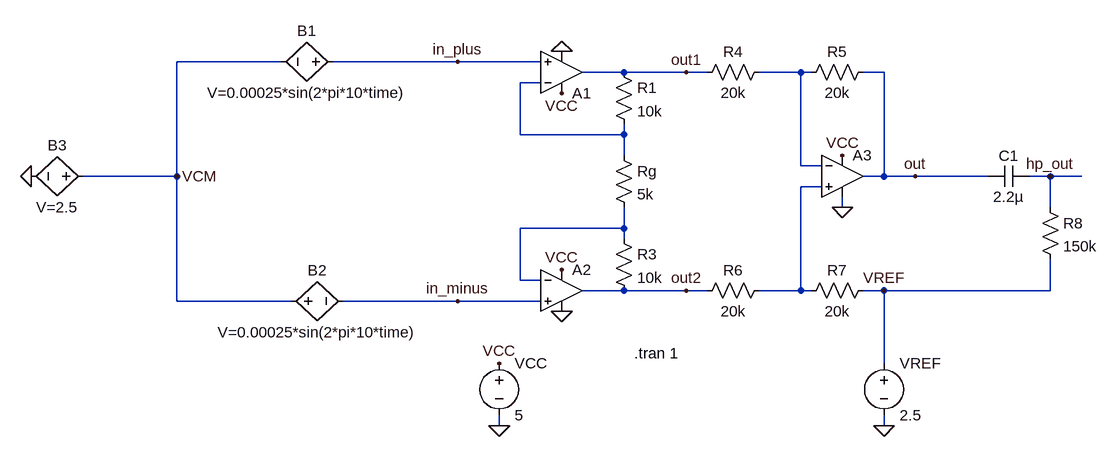
[diagram p0: schematic ecg_front_end_highpass.asc]
ecg_front_end_highpass.asc, the LTspice schematic file:
Version 4.1
SHEET 1 896 680
WIRE -368 -128 -528 -128
WIRE -96 -128 -288 -128
WIRE 32 -128 -96 -128
WIRE 160 -112 96 -112
WIRE 256 -112 160 -112
WIRE 288 -112 256 -112
WIRE 432 -112 368 -112
WIRE 448 -112 432 -112
WIRE 560 -112 528 -112
WIRE 32 -96 0 -96
WIRE 0 -16 0 -96
WIRE 160 -16 160 -32
WIRE 160 -16 0 -16
WIRE 160 16 160 -16
WIRE 432 32 432 -112
WIRE 464 32 432 32
WIRE -528 48 -528 -128
WIRE -528 48 -672 48
WIRE 560 48 560 -112
WIRE 560 48 528 48
WIRE 608 48 560 48
WIRE 720 48 608 48
WIRE 816 48 784 48
WIRE 864 48 816 48
WIRE 464 64 432 64
WIRE 496 96 496 80
WIRE 816 96 816 48
WIRE 160 128 160 96
WIRE 160 128 0 128
WIRE 160 144 160 128
WIRE 0 208 0 128
WIRE 32 208 0 208
WIRE 160 224 96 224
WIRE 256 224 160 224
WIRE 288 224 256 224
WIRE 432 224 432 64
WIRE 432 224 368 224
WIRE 448 224 432 224
WIRE 560 224 528 224
WIRE 816 224 816 176
WIRE 816 224 560 224
WIRE -528 240 -528 48
WIRE -352 240 -528 240
WIRE -96 240 -272 240
WIRE 32 240 -96 240
WIRE 560 336 560 224
WIRE -32 432 -32 416
WIRE 560 432 560 416
FLAG -32 432 0
FLAG 496 96 0
FLAG 560 432 0
FLAG 560 224 VREF
FLAG -32 336 VCC
FLAG 496 16 VCC
FLAG 64 -80 VCC
FLAG 64 192 VCC
FLAG 64 -144 0
FLAG 64 256 0
FLAG -96 -128 in_plus
FLAG -96 240 in_minus
FLAG 256 -112 out1
FLAG 256 224 out2
FLAG 608 48 out
FLAG -752 48 0
FLAG -528 48 VCM
FLAG 816 48 hp_out
SYMBOL OpAmps\\UniversalOpAmp2 496 48 R0
SYMATTR InstName A3
SYMBOL voltage -32 320 R0
WINDOW 123 0 0 Left 0
WINDOW 39 0 0 Left 0
SYMATTR InstName VCC
SYMATTR Value 5
SYMBOL voltage 560 320 R0
WINDOW 123 0 0 Left 0
WINDOW 39 0 0 Left 0
SYMATTR InstName VREF
SYMATTR Value 2.5
SYMBOL OpAmps\\UniversalOpAmp2 64 -112 M180
SYMATTR InstName A1
SYMBOL OpAmps\\UniversalOpAmp2 64 224 R0
SYMATTR InstName A2
SYMBOL res 144 -128 R0
SYMATTR InstName R1
SYMATTR Value 10k
SYMBOL res 144 0 R0
SYMATTR InstName Rg
SYMATTR Value 5k
SYMBOL res 144 128 R0
SYMATTR InstName R3
SYMATTR Value 10k
SYMBOL res 384 -128 R90
WINDOW 0 0 56 VBottom 2
WINDOW 3 32 56 VTop 2
SYMATTR InstName R4
SYMATTR Value 20k
SYMBOL res 544 -128 R90
WINDOW 0 0 56 VBottom 2
WINDOW 3 32 56 VTop 2
SYMATTR InstName R5
SYMATTR Value 20k
SYMBOL res 384 208 R90
WINDOW 0 0 56 VBottom 2
WINDOW 3 32 56 VTop 2
SYMATTR InstName R6
SYMATTR Value 20k
SYMBOL res 544 208 R90
WINDOW 0 0 56 VBottom 2
WINDOW 3 32 56 VTop 2
SYMATTR InstName R7
SYMATTR Value 20k
SYMBOL bv -272 -128 R90
WINDOW 0 -32 56 VBottom 2
WINDOW 3 32 56 VTop 2
SYMATTR InstName B1
SYMATTR Value V=0.00025*sin(2*pi*10*time)
SYMBOL bv -368 240 M90
WINDOW 0 -32 56 VBottom 2
WINDOW 3 32 56 VTop 2
SYMATTR InstName B2
SYMATTR Value V=0.00025*sin(2*pi*10*time)
SYMBOL bv -656 48 R90
WINDOW 0 -32 56 VBottom 2
WINDOW 3 32 56 VTop 2
SYMATTR InstName B3
SYMATTR Value V=2.5
SYMBOL cap 784 32 R90
WINDOW 0 0 32 VBottom 2
WINDOW 3 32 32 VTop 2
SYMATTR InstName C1
SYMATTR Value 2.2µ
SYMBOL res 800 80 R0
SYMATTR InstName R8
SYMATTR Value 150k
TEXT 176 320 Left 2 !.tran 1

The netlist it stands for:
* ecg_front_end_highpass.asc
X§A3 N003 N001 VCC 0 out level2 Avol=1Meg GBW=10Meg Slew=10Meg Ilimit=25m Rail=0 Vos=0 En=0 Enk=0 In=0 Ink=0 Rin=500Meg  ; pins In+ In- V+ V- OUT
VCC VCC 0 5
VREF VREF 0 2.5
X§A1 in_plus N002 VCC 0 out1 level2 Avol=1Meg GBW=10Meg Slew=10Meg Ilimit=25m Rail=0 Vos=0 En=0 Enk=0 In=0 Ink=0 Rin=500Meg  ; pins In+ In- V+ V- OUT
X§A2 in_minus N004 VCC 0 out2 level2 Avol=1Meg GBW=10Meg Slew=10Meg Ilimit=25m Rail=0 Vos=0 En=0 Enk=0 In=0 Ink=0 Rin=500Meg  ; pins In+ In- V+ V- OUT
R1 out1 N002 10k
Rg N002 N004 5k
R3 N004 out2 10k
R4 N001 out1 20k
R5 out N001 20k
R6 N003 out2 20k
R7 VREF N003 20k
B1 in_plus VCM V=0.00025*sin(2*pi*10*time)
B2 VCM in_minus V=0.00025*sin(2*pi*10*time)
B3 VCM 0 V=2.5
C1 hp_out out 2.2µ
R8 hp_out VREF 150k
.tran 1
.lib UniversalOpAmp2.lib
.backanno
.end